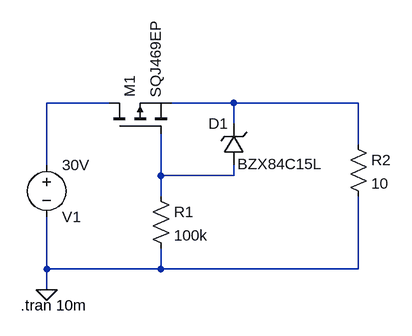
[diagram p0: schematic TERS_POLARİTE_TEST.asc]
TERS_POLARİTE_TEST.asc, the LTspice schematic file:
Version 4.1
SHEET 1 880 680
WIRE 160 128 64 128
WIRE 352 128 256 128
WIRE 544 128 352 128
WIRE 352 160 352 128
WIRE 544 192 544 128
WIRE 64 224 64 128
WIRE 240 240 240 176
WIRE 352 240 352 224
WIRE 352 240 240 240
WIRE 240 272 240 240
WIRE 64 384 64 304
WIRE 240 384 240 352
WIRE 240 384 64 384
WIRE 544 384 544 272
WIRE 544 384 240 384
WIRE 64 416 64 384
FLAG 64 416 0
SYMBOL pmos 160 176 R270
SYMATTR InstName M1
SYMATTR Value SQJ469EP
SYMBOL res 224 256 R0
SYMATTR InstName R1
SYMATTR Value 100k
SYMBOL zener 368 224 R180
WINDOW 0 24 64 Left 2
WINDOW 3 -121 2 Left 2
SYMATTR InstName D1
SYMATTR Value BZX84C15L
SYMBOL res 528 176 R0
SYMATTR InstName R2
SYMATTR Value 10
SYMBOL voltage 64 208 R0
WINDOW 0 24 96 Left 2
WINDOW 3 24 16 Left 2
WINDOW 123 0 0 Left 0
WINDOW 39 0 0 Left 0
SYMATTR InstName V1
SYMATTR Value 30V
TEXT 24 440 Left 2 !.tran 10m

The netlist it stands for:
* TERS_POLARİTE_TEST.asc
M1 N001 N003 N002 N002 SQJ469EP
R1 N003 0 100k
D1 N003 N002 BZX84C15L
R2 N002 0 10
V1 N001 0 30V
.model D D
.lib standard.dio
.model NMOS NMOS
.model PMOS PMOS
.lib standard.mos
.tran 10m
.backanno
.end